# EAGLE design fMeter-preamp (EAGLE 5.07)
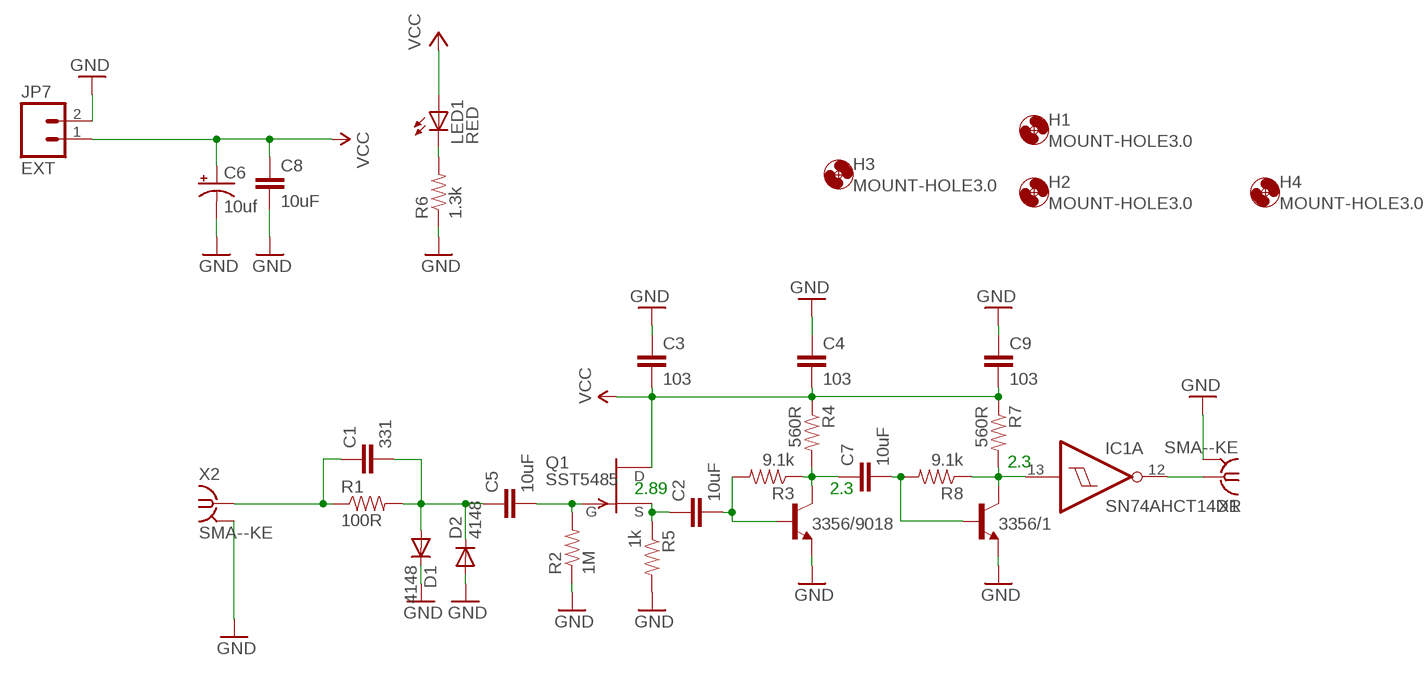
[diagram p0: schematic, sheet 1]

## Parts
3356/1  -NPN-SOT23-BEC  [SOT23-BEC]
3356/9018  -NPN-SOT23-BEC  [SOT23-BEC]
C1  331  CAP-C1206  [C1206]
C2  10uF  CAP-C1206  [C1206]
C3  103  CAP-C0805  [C0805]
C4  103  CAP-C0805  [C0805]
C5  10uF  CAP-C1206  [C1206]
C6  10uf  CAP_POL7343  [EIA7343]
C7  10uF  CAP-C0805  [C0805]
C8  10uF  CAP-C1206  [C1206]
C9  103  CAP-C0805  [C0805]
D1  4148  DIODE1206  [1206-DIODE]
D2  4148  DIODE1206  [1206-DIODE]
H1  MOUNT-HOLE3.0  [3,0]
H2  MOUNT-HOLE3.0  [3,0]
H3  MOUNT-HOLE3.0  [3,0]
H4  MOUNT-HOLE3.0  [3,0]
IC1  SN74AHCT14DR  74HC14D  [SO14]
JP7  EXT  CON-02-XH  [XH-1X2-LONG-LOCK]
LED1  RED  LEDCHIP-LED0805  [CHIP-LED0805]
Q1  SST5485  [SOT23]
R1  100R  RESISTOR-R0805W  [R0805W]
R2  1M  RESISTOR-R0805W  [R0805W]
R3  9.1k  RESISTOR0805  [0805]
R4  560R  RESISTOR-R0805W  [R0805W]
R5  1k  RESISTOR-R0805W  [R0805W]
R6  1.3k  RESISTOR0805  [0805]
R7  560R  RESISTOR-R0805W  [R0805W]
R8  9.1k  RESISTOR-R0805W  [R0805W]
X1  SMA--KE  [SMA-KE]
X2  SMA--KE  [SMA-KE]

## Nets
GND: 3356/1.E 3356/9018.E C3.1 C4.1 C6.C(-) C8.2 C9.1 D1.K(C) D2.A JP7.2 R2.1 R5.2 R6.1 X1.G@1(GND) X2.G@1(GND)
N$1: C1.1 R1.1 X2.1
N$2: C1.2 C5.1 D1.A D2.K(C) R1.2
N$3: C2.1 Q1.2(S) R5.1
N$4: 3356/9018.B C2.2 R3.2
N$5: 3356/9018.C C7.1 R3.1 R4.2
N$6: C5.2 Q1.3(G) R2.2
N$7: IC1.12(A:O) X1.1
N$8: 3356/1.C IC1.13(A:I) R7.2 R8.1
N$9: 3356/1.B C7.2 R8.2
N$32: LED1.C R6.2
VCC: C3.2 C4.2 C6.A(+) C8.1 C9.2 JP7.1 LED1.A Q1.1(D) R4.1 R7.1
Unconnected: IC1.1(D:I) IC1.2(D:O) IC1.3(E:I) IC1.4(E:O) IC1.5(F:I) IC1.6(F:O) IC1.8(C:O) IC1.9(C:I) IC1.10(B:O) IC1.11(B:I)

## Notes on the sheet
- 2.3
- 2.89 | 2.3

## Power pins joined to a net without a drawn wire
GND: IC1.7(P:GND) X1.G@2(GND) X1.G@3(GND) X1.G@4(GND) X2.G@2(GND) X2.G@3(GND) X2.G@4(GND)
VCC: IC1.14(P:VCC)

## Library data of the parts
3356/1 3356/9018 = digital-toy:*-NPN-: NPN Transistror most of sot-23 use the pacages sot23-BEC, top C, left B, right E. by hyl, digital-toy. and to-92 use ebc(from-top) by hyl, digital-toy.
C1-C5 C7-C9 = digital-toy:CAP: Capacitor Standard 0603 ceramic capacitor, and 0.1" leaded capacitor.
C6 = digital-toy:CAP_POL: Capacitor Polarized These are standard SMD and PTH capacitors. Normally 10uF, 47uF, and 100uF in electrolytic and tantalum varieties. Always verify the external diameter of the through hole cap, it varies with capacity, voltage, and manufacturer. The EIA devices should be standard. PANASONIC_D size: 6.5mmx6.5mmx5.5mm, 100uf (taobao:6.3mmx5.5mm), same as CVL0605 153cvl0405 size: 4mmx4mmx5.5mm, 10uf (taobao:4mmx5.5mm) ct6032 typical 47uF Tantalum, comment by hyl.
D1 D2 = digital-toy:DIODE: Diode These are standard reverse protection diodes and small signal diodes. SMA package can handle up to about 1A. SOD-323 can handle about 200mA. What the SOD-323 package when ordering, there are some mfgs out there that are 5-pin packages.
H1-H4 = holes:MOUNT-HOLE: MOUNTING HOLE with drill center marker
IC1 = 74xx-eu:74*14: Hex schmitt trigger INVERTER
JP7 = digital-toy:CON-02: Header 2 Standard 2-pin 0.1" header. Use with straight break away headers (SKU : PRT-00116), right angle break away headers (PRT-00553), swiss pins (PRT-00743), machine pins (PRT-00117), and female headers (PRT-00115). Molex polarized connector foot print use with SKU : PRT-08233 with associated crimp pins and housings.
LED1 = led:LED: LED OSRAM: - CHIPLED LG R971, LG N971, LY N971, LG Q971, LY Q971, LO R971, LY R971 LH N974, LH R974 LS Q976, LO Q976, LY Q976 LO Q996 - Hyper CHIPLED LW Q18S LB Q993, LB Q99A, LB R99A - SideLED LS A670, LO A670, LY A670, LG A670, LP A670 LB A673, LV A673, LT A673, LW A673 LH A674 LY A675 LS A676, LA A676, LO A676, LY A676, LW A676 LS A679, LY A679, LG A679 - Hyper Micro SIDELED® LS Y876, LA Y876, LO Y876, LY Y876 LT Y87S - SmartLED LW L88C, LW L88S LB L89C, LB L89S, LG L890 LS L89K, LO L89K, LY L89K LS L896, LA L896, LO L896, LY L896 - TOPLED LS T670, LO T670, LY T670, LG T670, LP T670 LSG T670, LSP T670, LSY T670, LOP T670, LYG T670 LG T671, LOG T671, LSG T671 LB T673, LV T673, LT T673, LW T673 LH T674 LS T676, LA T676, LO T676, LY T676, LB T676, LH T676, LSB T676, LW T676 LB T67C, LV T67C, LT T67C, LS T67K, LO T67K, LY T67K, LW E67C LS E67B, LA E67B, LO E67B, LY E67B, LB E67C, LV E67C, LT E67C LW T67C LS T679, LY T679, LG T679 LS T770, LO T770, LY T770, LG T770, LP T770 LB T773, LV T773, LT T773, LW T773 LH T774 LS E675, LA E675, LY E675, LS T675 LS T776, LA T776, LO T776, LY T776, LB T776 LHGB T686 LT T68C, LB T68C - Hyper Mini TOPLED® LB M676 - Mini TOPLED Santana® LG M470 LS M47K, LO M47K, LY M47K Source: http://www.osram.convergy.de LUXEON: - LUMILED® LXK2-PW12-R00, LXK2-PW12-S00, LXK2-PW14-U00, LXK2-PW14-V00 LXK2-PM12-R00, LXK2-PM12-S00, LXK2-PM14-U00 LXK2-PE12-Q00, LXK2-PE12-R00, LXK2-PE12-S00, LXK2-PE14-T00, LXK2-PE14-U00 LXK2-PB12-K00, LXK2-PB12-L00, LXK2-PB12-M00, LXK2-PB14-N00, LXK2-PB14-P00, LXK2-PB14-Q00 LXK2-PR12-L00, LXK2-PR12-M00, LXK2-PR14-Q00, LXK2-PR14-R00 LXK2-PD12-Q00, LXK2-PD12-R00, LXK2-PD12-S00 LXK2-PH12-R00, LXK2-PH12-S00 LXK2-PL12-P00, LXK2-PL12-Q00, LXK2-PL12-R00 Source: www.luxeon.com KINGBRIGHT: KA-3528ASYC Source: www.kingbright.com
Q1 = transistor-fet:?548*: N-Channel JFETs Source: VISHAY 2N5484.pdf Compatible: TO92 2N5245 J304 J305 U310 J308 J309 J310 TO72 2N4416 2N4416A 2N3823 2N4351 3N169 3N170 3N171 MFE3002 TO18 2N3796 2N3797 MFE825 Source: Motorola European Master Guide Pacge 3-59
R1-R8 = digital-toy:RESISTOR: Resistor Basic schematic elements and footprints for 0603, 1206, and PTH 1/10th watt (small) resistors. digital-toy copy vertical mount of axial-0.3 from rcl.lbr : the 0207/xx
X1 X2 = dtoy-RF:SMA-: SMA 50 Ohm End Launch Jack Receptacle - Round Contact Johnson Components Source: www.johnsoncomponents.com .. J502-ND.pdf

## Board
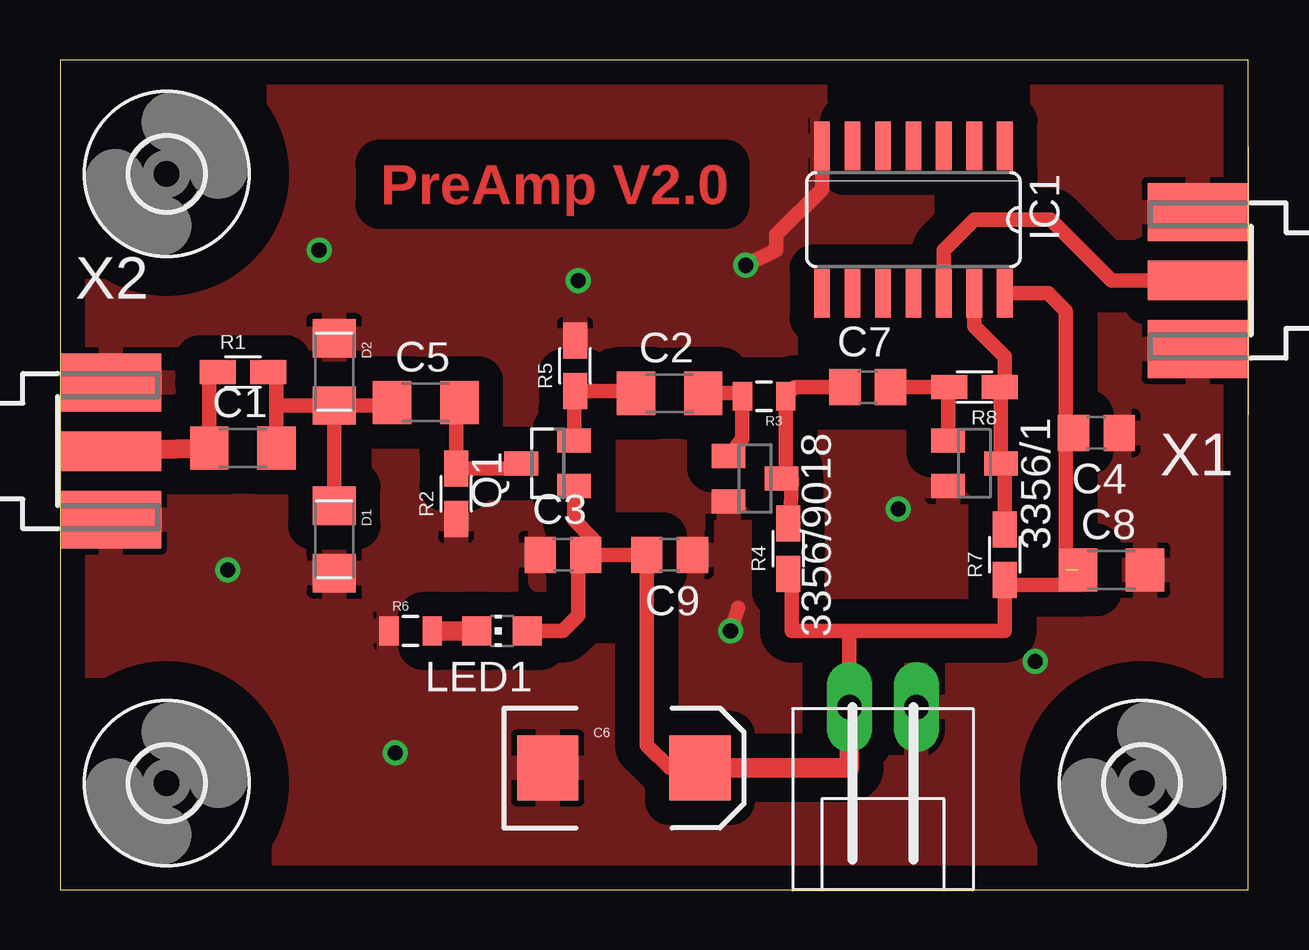
[diagram p1: board, top side]
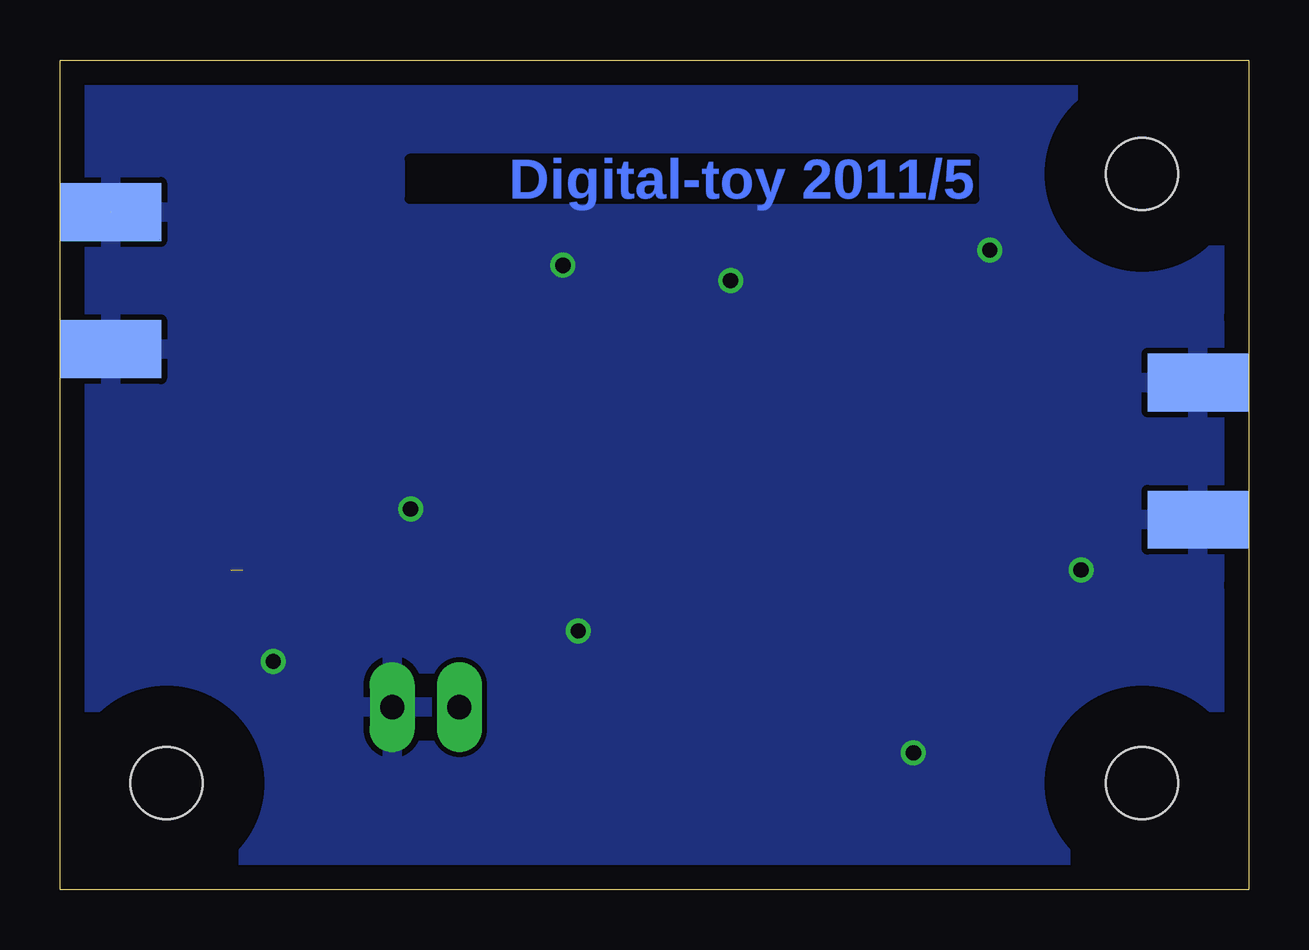
[diagram p2: board, bottom side, seen from below]

Size 49.53 x 34.59 mm. Coordinates in mm from the lower left corner, seen from the top.
Outline: 0,0 49.51,0 49.51,34.59 0,34.59 0,0
Copper layers (1*16): Top 0.035mm / dielectric 1.5mm / Bottom 0.035mm
Design rules "default": minimum track width 10mil, minimum drill 24mil, track to track 8mil, track to pad 8mil, pad to pad 8mil, via to via 8mil, smd to smd 8mil, copper to edge 40mil, drill to drill 8mil, minimum pad ring 10mil, minimum via ring 8mil, stop-mask expansion 4mil, vias tented up to drill 0mil, thermal gap 10mil

### Footprints (pad centres in the part's own frame; a part is rotated, then mirrored left to right if it is on the bottom)
SOT23-BEC = smd 1 x 1.4: B -0.95,-1.1; C 0,1.1; E 0.95,-1.1
C1206 = smd 1.6 x 1.8: 1 -1.4,0; 2 1.4,0
C0805 = smd 1.3 x 1.5: 1 -0.95,0; 2 0.95,0
EIA7343 = smd 2.55 x 2.7: A 3.17,0; C -3.17,0
1206-DIODE = smd 1.6 x 1.8: A -1.4,0; K 1.4,0
3,0 = hole 3: 0,0
SO14 = smd 0.66 x 2.032: 1 -3.81,-3.073; 2 -2.54,-3.073; 3 -1.27,-3.073; 4 0,-3.073; 5 1.27,-3.073; 6 2.54,-3.073; 7 3.81,-3.073; 8 3.81,3.073; 9 2.54,3.073; 10 1.27,3.073; 11 0,3.073; 12 -1.27,3.073; 13 -2.54,3.073; 14 -3.81,3.073
XH-1X2-LONG-LOCK = drill 1.016 pad 1.88 long: 1 1.397,0; 2 -1.397,0
CHIP-LED0805 = smd 1.2 x 1.2: A 0,-1.05; C 0,1.05
SOT23 = smd 1 x 1.4: 1 -0.95,-1.1; 2 0.95,-1.1; 3 0,1.1
R0805W = smd 1.5 x 1: 1 -1.052,0; 2 1.052,0
0805 = smd 0.8 x 1.2: 1 -0.9,0; 2 0.9,0
SMA-KE = smd 4.191 x 1.651: 1 2.115,0 | smd 4.191 x 2.413: G@1 2.115,2.86; G@2 2.115,-2.86 | smd 4.191 x 2.413 bottom: G@3 2.115,2.86; G@4 2.115,-2.86

### Placement (x,y rotation side)
3356/1  38.1,17.78 270 top
3356/9018  28.96,17.14 270 top
C1  7.62,18.41 0 top
C2  25.4,20.7 0 top
C3  20.95,13.97 0 top
C4  43.18,19.05 180 top
C5  15.24,20.32 0 top
C6  23.5,5.08 0 top
C7  33.66,20.95 0 top
C8  43.81,13.34 0 top
C9  25.4,13.97 180 top
D1  11.43,14.61 270 top
D2  11.43,21.59 270 top
H1  4.45,4.45 0 top
H2  59.69,16.51 0 top  (outside the outline)
H3  4.45,29.84 0 top
H4  45.09,4.45 0 top
IC1  35.56,27.94 180 top
JP7  34.29,7.62 180 top
LED1  18.41,10.79 90 top
Q1  20.32,17.78 90 top
R1  7.62,21.59 0 top
R2  16.51,16.51 90 top
R3  29.34,20.57 180 top
R4  30.35,14.22 90 top
R5  21.46,21.84 90 top
R6  14.61,10.79 0 top
R7  39.37,13.97 90 top
R8  38.1,20.95 180 top
X1  49.53,25.4 180 top
X2  0,18.29 0 top

### Tracks (layer width: path | path; a pad name or v marks a point on that pad's centre or on a via)
GND  (via drill 0.64)  (1 unrouted)
  Top 0.61: IC1.7 31.75,29.21 29.84,27.3 29.84,26.67 v28.57,26.04 | v27.94,10.79 28.26,11.74
  other vias: 10.79,26.67 21.59,25.4 13.97,5.71 6.99,13.34 40.64,9.53 34.92,15.88
  pour Top (isolate 1.016): 0,46.99 64.77,46.99 69.85,26.67 69.85,3.81 67.31,-15.24 2.54,-15.24 -11.43,1.27 -11.43,39.37
  pour Bottom: -5.71,34.92 50.8,34.92 55.88,29.84 48.26,-3.81 -1.27,-3.81 -6.99,1.91 -6.99,33.66
N$1
  Top 0.61: C1.1 6.22,21.24 R1.1
  Top 0.813: X2.1 C1.1
N$2
  Top 0.61: C1.2 9.02,20.32 | 9.02,20.32 9.02,21.46 8.89,21.59 R1.2 | D2.K 9.15,20.19 9.02,20.32 | D2.K D1.A | D2.K 13.71,20.19 C5.1
N$3
  Top 0.61: Q1.2 21.42,20.75 R5.1 23.91,20.79 C2.1
N$4
  Top 0.61: C2.2 28.31,20.7 R3.2 28.44,18.78 3356/9018.B
N$5
  Top 0.61: C7.1 30.62,20.95 R3.1 30.24,17.33 3356/9018.C 29.84,16.93 30.48,17.14 30.44,15.91 R4.2
N$6
  Top 0.61: C5.2 16.51,20.19 R2.2 19,17.56 Q1.3
N$7
  Top 0.61: IC1.12 36.83,26.67 38.1,27.94 41.27,27.94 43.81,25.4 X1.1
N$8
  Top 0.61: R7.2 39.37,17.61 3356/1.C 39.2,20.91 R8.1 39.37,21.17 39.37,22.23 38.1,23.5 IC1.13
N$9
  Top 0.61: 3356/1.B 37,20.91 R8.2 C7.2 34.29,20.95
N$32
  Top 0.813: LED1.C R6.2
VCC  (1 unrouted)
  Top 0.61: Q1.1 21.42,15.41 22.23,14.61 22.23,14.29 C3.2 | LED1.A 20.95,10.79 21.59,11.43 21.59,13.65 C3.2 | C3.2 C9.2 24.45,6.03 25.4,5.08 C6.A | 41.91,13.34 41.91,18.73 C4.2 41.91,19.37 41.91,24.13 41.17,24.87 IC1.14 | JP7.1 32.89,10.79 | 32.89,10.79 30.48,10.79 30.48,13.17 R4.1 | C8.1 42.55,13.34 42.55,12.7 39.37,12.7 R7.1 39.37,10.79 32.89,10.79
  Top 0.813: JP7.1 32.89,5.08 C6.A

### Text on the board
Top: PreAmp V2.0
Bottom: Digital-toy 2011/5